# Altium project MB1520.PrjPcb (part 2 of 5)

## Sheet USB OTG FS.SchDoc: USB OTG FS
size A4; CompanyName: STMicroelectronics; Organization: Microcontrollers Division; DocumentNumber: 15; SheetNumber: 7; SheetTotal: 19
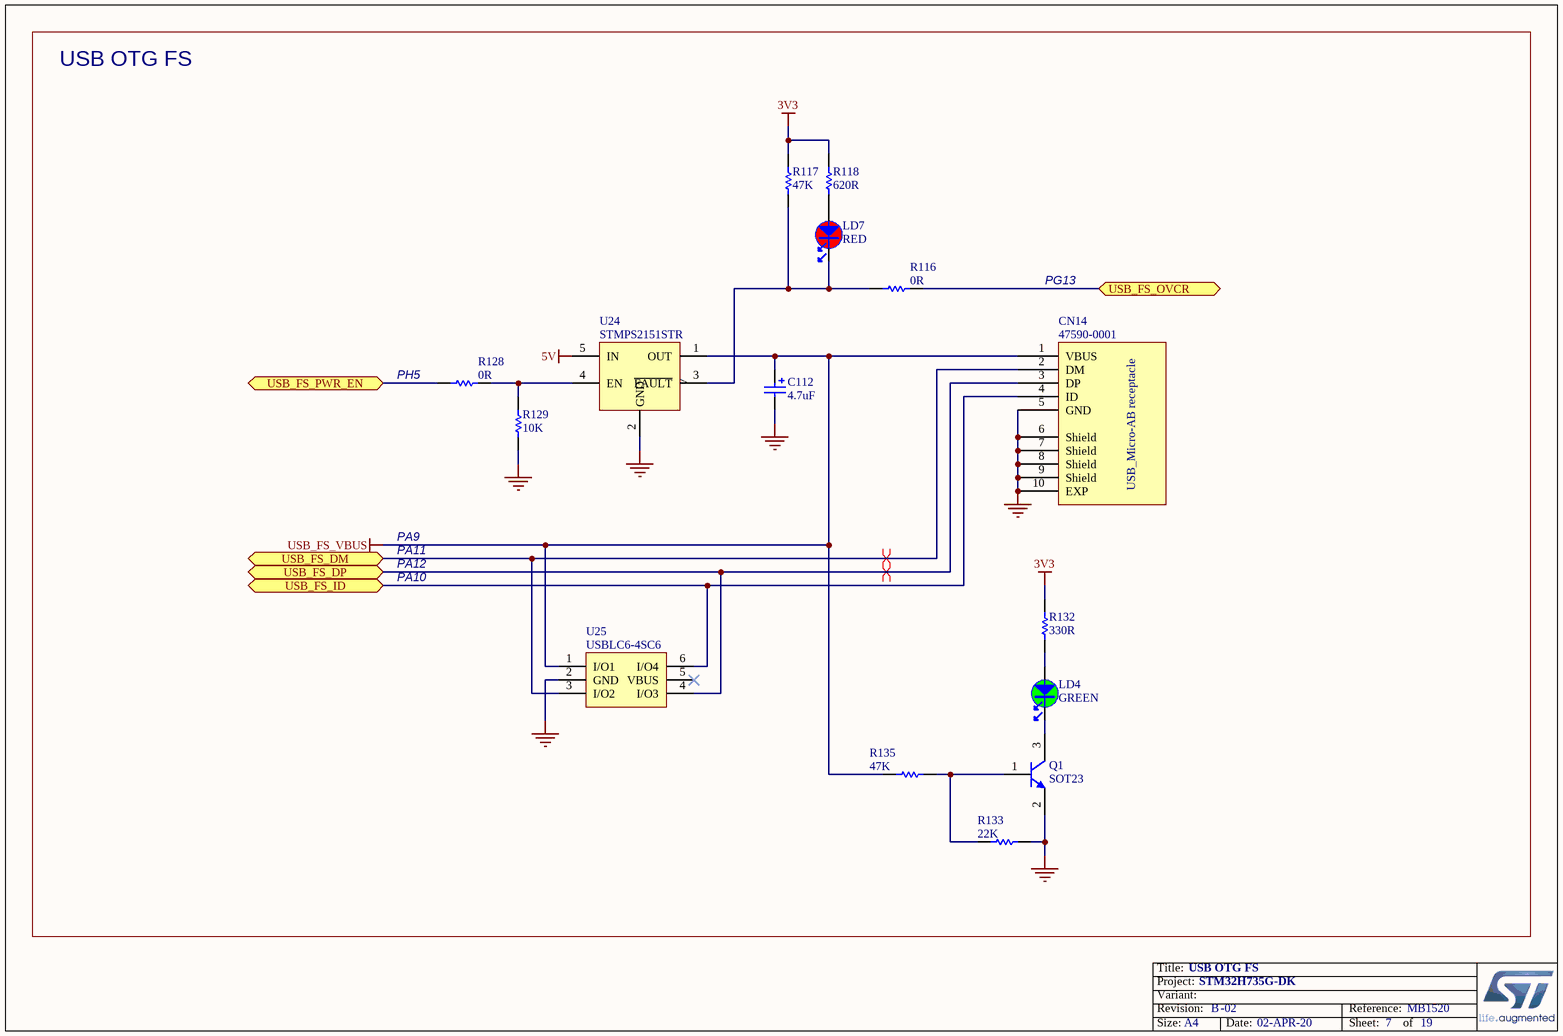
[diagram p5: USB OTG FS.SchDoc]

### Parts
C112  value 4.7uF  [CPOL_VISHAY_TANTAL-595D_1407_H220]  (hidden comment: Cap_POL_TANA)
CN14  Manufacturer_Part_Number: 47590-0001  [CON_USBMICROAB_MOLEX_47590-0001_H3]  (hidden comment: USB_uAB_47590.0001)
LD4  value GREEN  [LED_0603_GREEN]  (hidden comment: LED_green)
LD7  value RED  [LED_0603_RED]  (hidden comment: LED_red)
Q1  value SOT23  [NPN_SOT23]  (hidden comment: 9013-SOT23)
R116  value 0R  [R0402]  (hidden comment: Resistor)
R117  value 47K  [R0402]  (hidden comment: Resistor)
R118  value 620R  [R0402]  (hidden comment: Resistor)
R128  value 0R  [R0402]  (hidden comment: Resistor)
R129  value 10K  [R0402]  (hidden comment: Resistor)
R132  value 330R  [R0402]  (hidden comment: Resistor)
R133  value 22K  [R0402]  (hidden comment: Resistor)
R135  value 47K  [R0402]  (hidden comment: Resistor)
U24  STMPS2151STR  [MOS_SOT23-5L]
U25  USBLC6-4SC6  [ESD_SOT23-6L]

### Ports
USB_FS_DM, USB_FS_DP, USB_FS_ID, USB_FS_OVCR, USB_FS_PWR_EN

### Nets
3V3: R117.2 R118.2 R132.2
5V: U24.5(IN)
GND: C112.2 CN14.5(GND) CN14.6(Shield) CN14.7(Shield) CN14.8(Shield) CN14.9(Shield) CN14.10(EXP) Q1.2(E) R129.1 R133.2 U24.2(GND) U25.2(GND)  [project net POE7]
USB_FS_VBUS: C112.1 CN14.1(VBUS) R135.2 U24.1(OUT) U25.1(I/O1)
USB_FS_DM: CN14.2(DM) U25.3(I/O2) ; port USB_FS_DM
USB_FS_DP: CN14.3(DP) U25.4(I/O3) ; port USB_FS_DP
USB_FS_ID: CN14.4(ID) U25.6(I/O4) ; port USB_FS_ID
USB_FS_OVCR: R116.2 ; port USB_FS_OVCR
USB_FS_PWR_EN: R128.1 ; port USB_FS_PWR_EN
NetLD4_1: LD4.1 R132.1
NetLD4_2: LD4.2 Q1.3(C)
NetLD7_1: LD7.1 R118.1
NetLD7_2: LD7.2 R116.1 R117.1 U24.3(~{FAULT})
NetQ1_1: Q1.1(B) R133.1 R135.1
NetR128_2: R128.2 R129.2 U24.4(EN)

Not connected (* = marked no-connect by the designer): U25 5(VBUS)*

### Layout directives
differential pair: USB_FS_DM, USB_FS_DP

### Notes on the sheet
- USB OTG FS
- PG13
- (near R128) PH5
- PA9
- PA10
- PA11
- PA12
- Title:
- Project:
- Size:
- Revision:
- Variant:
- A4
- -
- Date:
- Reference:
- Sheet:
- of
- (in symbol MCD-00022) USB_Micro-AB receptacle

### Library data of the parts
C112 = MCD-00595: Capacitor, Tantalum, 4.7uF, 16V, +/-10%, 595D case A; Manufacturer_Part_Number: 595D475X9016A2T; Manufacturer: VISHAY; Order_Code_RS: 117-303; Provided_By: SUBCO; Revision: July-2002: Re-released for DXP Platform.; Internal_Part_Number: MCD-00595; Status: Footprint available; Part_Type: Capacitor; ComponentLink1Description: Datasheet; ComponentLink1URL: http://tunmcdsvn.tun.st.com/Component_Datasheet_Library/Trunk/Capacitors/VISHAY_CAPACITOR_TANTALUM_595D; Order_Code_Digikey: 595D475X9016A2T-ND; Order_Code_Farnell: 1166805
CN14 = MCD-00022: USB-MICRO-AB, 0.65mm, RA, SMT, Top Mount (compatible with MCD-00661 USB certified); Part_Type: Connector; Manufacturer: MOLEX; Alternate_Manufacturer_Part_Number: ZX62RD-AB-5P8(30); Alternate_Manufacturer: HIROSE; Provided_By: SUBCO; Internal_Part_Number: MCD-00022; Value: USB_uAB_47590.0001; Status: Released; ComponentLink1Description: Datasheet; ComponentLink1URL: http://tunmcdsvn.tun.st.com/Component_Datasheet_Library/Trunk/Connectors/Molex_Connector-USB-microAB_47590-0001
LD4 = MCD-00050: LED, Green, 0603; Part_Type: Display; Manufacturer_Part_Number: 19-213SYGC/S530-E2/TR8; Manufacturer: EVERLIGHT; Provided_By: SUBCO; Internal_Part_Number: MCD-00050; Status: Released; ComponentLink1Description: Datasheet; ComponentLink1URL: http://tunmcdsvn.tun.st.com/Component_Datasheet_Library/Trunk/Display/Everlight_SMD-LED-GREEN_19-213SYGC-S530-XX-TR8-v3.doc; Package: LED 0603
LD7 = MCD-00049: LED, Red, 0603; Manufacturer_Part_Number: 19-213-R6C-AP1Q2B/3T; Manufacturer: EVERLIGHT; Part_Type: Display; Provided_By: SUBCO; Internal_Part_Number: MCD-00049; ComponentLink1Description: Datasheet; Status: Released; ComponentLink1URL: http://tunmcdsvn.tun.st.com/Component_Datasheet_Library/Trunk/Display/Everlight_SMD-LED-RED_19-213-R6C-AP1Q2B-3T-V3.doc; Package: LED 0603
Q1 = MCD-00073: NPN Bipolar Transistor; Part_Type: IC; Manufacturer_Part_Number: BSR14; Manufacturer: ON SEMICONDUCTOR; Alternate_Manufacturer_Part_Number: MMBT2222ALT1G / MMBT2222ALT3G; Provided_By: SUBCO; Revision: *; Internal_Part_Number: MCD-00073; Status: Released; ComponentLink1Description: Datasheet; ComponentLink1URL: http://tunmcdsvn.tun.st.com/Component_Datasheet_Library/Trunk/IC/NXP_Transistor_BSR14; Alternate_Manufacturer: ON SEMICONDUCTOR
R116 R128 = MCD-00052: Resistor,0R,0402,5%,1/16W; Manufacturer_Part_Number: RC0402JR-070RL; Manufacturer: YAGEO; Provided_By: SUBCO; Internal_Part_Number: MCD-00052; Status: Released; Part_Type: Resistor; Package: R0402; ComponentLink1Description: Datasheet; ComponentLink1URL: http://tunmcdsvn.tun.st.com/Component_Datasheet_Library/Trunk/Resistors/Yageo_Resistor_RC0402-series
R117 R135 = MCD-00063: Resistor,47K,0402,1%,1/16W; Manufacturer_Part_Number: RC0402FR-0747KL; Manufacturer: YAGEO; Provided_By: SUBCO; Internal_Part_Number: MCD-00063; Status: Released; Part_Type: Resistor; Package: R0402; ComponentLink1Description: Datasheet; ComponentLink1URL: http://tunmcdsvn.tun.st.com/Component_Datasheet_Library/Trunk/Resistors/Yageo_Resistor_RC0402-series
R118 = MCD-00499: Resistor,620R,0402,1%,1/16W; Manufacturer_Part_Number: RC0402FR-07620RL; Manufacturer: YAGEO; Provided_By: SUBCO; Internal_Part_Number: MCD-00499; Status: Released; Part_Type: Resistor; Package: R0402; ComponentLink1Description: Datasheet; ComponentLink1URL: http://tunmcdsvn.tun.st.com/Component_Datasheet_Library/Trunk/Resistors/Yageo_Resistor_RC0402-series
R129 = MCD-00053: as R94 on sheet Audio; Internal_Part_Number: MCD-00053; Status: Released; Part_Type: Resistor; Package: R0402; ComponentLink1Description: Datasheet; ComponentLink1URL: http://tunmcdsvn.tun.st.com/Component_Datasheet_Library/Trunk/Resistors/Yageo_Resistor_RC0402-series
R132 = MCD-00062: Resistor,330R,0402,1%,1/16W; Manufacturer_Part_Number: RC0402FR-07330RL; Manufacturer: YAGEO; Provided_By: SUBCO; Internal_Part_Number: MCD-00062; Status: Released; Part_Type: Resistor; Package: R0402; ComponentLink1Description: Datasheet; ComponentLink1URL: http://tunmcdsvn.tun.st.com/Component_Datasheet_Library/Trunk/Resistors/Yageo_Resistor_RC0402-series
R133 = MCD-00429: Resistor,22K,0402,1%,1/16W; Manufacturer_Part_Number: RC0402FR-0722KL; Manufacturer: YAGEO; Provided_By: SUBCO; Internal_Part_Number: MCD-00429; Status: Released; Part_Type: Resistor; Package: R0402; ComponentLink1Description: Datasheet; ComponentLink1URL: http://tunmcdsvn.tun.st.com/Component_Datasheet_Library/Trunk/Resistors/Yageo_Resistor_RC0402-series
U24 = MCD-00159: 500mA, Enhanced single channel power switches with active high enable pin; Part_Type: IC; Manufacturer: STMICROELECTRONICS; Alternate_Manufacturer_Part_Number: TPS2051C; Alternate_Manufacturer: TEXAS INSTRUMENTS; BMS_Part_Number: 9159009; Provided_By: SUBCO with ST control; Internal_Part_Number: MCD-00159; Value: STMPS2151STR; Status: Released; Manufacturer_Part_Number: STMPS2151STR; ComponentLink1Description: Datasheet; ComponentLink1URL: http://tunmcdsvn.tun.st.com/Component_Datasheet_Library/Trunk/IC/STM_PWR-Switch_STMPS2151STR
U25 = MCD-00250: Very low capacitance ESD protection , 4 lines; Part_Type: IC; Manufacturer: STMICROELECTRONICS; BMS_Part_Number: 9151001; Provided_By: SUBCO with ST control; Internal_Part_Number: MCD-00250; Value: USBLC6-4SC6; Status: Released; Manufacturer_Part_Number: USBLC6-4SC6; ComponentLink1Description: Datasheet; ComponentLink1URL: http://tunmcdsvn.tun.st.com/Component_Datasheet_Library/Trunk/Diodes/STM_ESD_USBLC6-4SC6

## Sheet Arduino Connector.SchDoc: Arduino Connector
size A4; CompanyName: STMicroelectronics; Organization: Microcontrollers Division; DocumentNumber: 10; SheetNumber: 16; SheetTotal: 19
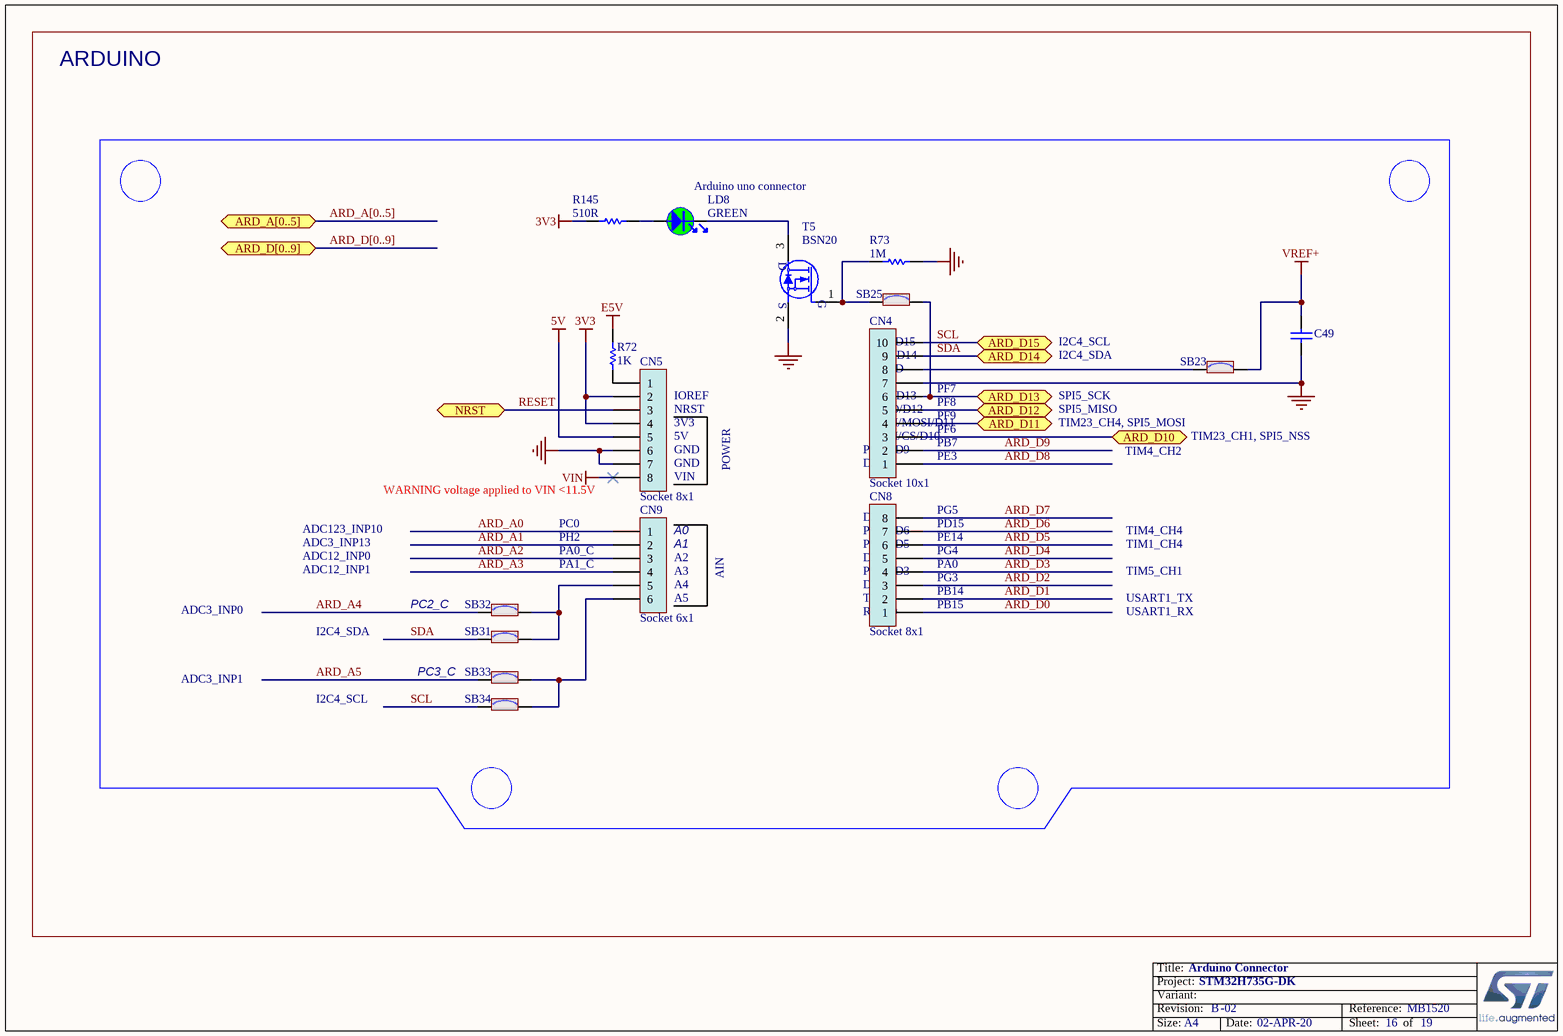
[diagram p6: Arduino Connector.SchDoc]

### Parts
C49  Capacitor  [C0603]  (value not drawn)
CN4  Socket 10x1  [CON_SAMTEC_SSW-110-22-X-S-VS]
CN5  Socket 8x1  [CON_SAMTEC_SSW-108-22-X-S-VS]
CN8  Socket 8x1  [CON_SAMTEC_SSW-108-22-X-S-VS]
CN9  Socket 6x1  [CON_SAMTEC_SSW-106-22-X-S-VS]
LD8  value GREEN  [LED_0603_GREEN]  (hidden comment: LED_green)
R72  value 1K  [R0603]  (hidden comment: Resistor)
R73  value 1M  [R0603]  (hidden comment: Resistor)
R145  value 510R  [R0603]  (hidden comment: Resistor)
SB23  SB_ON  [SOLDER-BRIDGE_R0603-0R]  (value not drawn)
SB25  SB_ON  [SOLDER-BRIDGE_R0603-0R]  (value not drawn)
SB31  SB_ON  [SOLDER-BRIDGE_R0603-0R]  (value not drawn)
SB32  SB_ON  [SOLDER-BRIDGE_R0603-0R]  (value not drawn)
SB33  SB_ON  [SOLDER-BRIDGE_R0603-0R]  (value not drawn)
SB34  SB_ON  [SOLDER-BRIDGE_R0603-0R]  (value not drawn)
T5  BSN20  [MOS_SOT23]

### Ports
ARD_A[0..5], ARD_D10, ARD_D11, ARD_D12, ARD_D13, ARD_D14, ARD_D15, ARD_D[0..9], NRST

### Nets
3V3: CN5.2 CN5.4 R145.2
5V: CN5.5
E5V: R72.1
GND: C49.1 CN4.7 CN5.6 CN5.7 R73.2 T5.2(S)  [project net POE7]
VIN: CN5.8
VREF+: C49.2 SB23.2
ARD_A0: CN9.1
ARD_A1: CN9.2
ARD_A2: CN9.3
ARD_A3: CN9.4
ARD_A4: SB32.1
ARD_A5: SB33.1
ARD_D0: CN8.1
ARD_D1: CN8.2
ARD_D2: CN8.3
ARD_D3: CN8.4
ARD_D4: CN8.5
ARD_D5: CN8.6
ARD_D6: CN8.7
ARD_D7: CN8.8
ARD_D8: CN4.1
ARD_D9: CN4.2
ARD_D10: CN4.3 ; port ARD_D10
ARD_D11: CN4.4 ; port ARD_D11
ARD_D12: CN4.5 ; port ARD_D12
ARD_D13: CN4.6 SB25.2 ; port ARD_D13
RESET: CN5.3 ; port NRST
SCL: CN4.10 SB34.1 ; port ARD_D15
SDA: CN4.9 SB31.1 ; port ARD_D14
NetCN4_8: CN4.8 SB23.1
NetCN5_1: CN5.1 R72.2
NetCN9_5: CN9.5 SB31.2 SB32.2
NetCN9_6: CN9.6 SB33.2 SB34.2
NetLD8_1: LD8.1 R145.1
NetLD8_2: LD8.2 T5.3(D)
NetR73_1: R73.1 SB25.1 T5.1(G)

### Buses and harness runs
bus ARD_A[0..5] = port ARD_A[0..5]
bus ARD_D[0..9] = port ARD_D[0..9]

### Notes on the sheet
- ARDUINO
- (near LD8) Arduino uno connector
- (near CN4) SDA/D14
- SCL/D15
- (near CN4) AVDD
- (near CN4) GND
- I2C4_SCL
- I2C4_SDA
- (near CN5) IOREF
- (near CN5) NRST
- (near CN5) 3V3
- (near CN5) 5V
- (near CN4) PWM/CS/D10
- (near CN4) SCK/D13
- (near CN4) MISO/D12
- (near CN4) PWM/MOSI/D11
- (near CN4) PF6
- (near CN4) PB7
- (near CN4) PF9
- (near CN4) PF8
- (near CN4) PF7
- TIM23_CH4, SPI5_MOSI
- SPI5_MISO
- SPI5_SCK
- TIM23_CH1, SPI5_NSS
- WARNING voltage applied to VIN <11.5V
- (near CN5) GND
- (near CN5) VIN
- POWER
- (near CN8) D7
- (near CN4) D8
- (near CN4) PWM/D9
- PG5
- (near CN4) PE3
- TIM4_CH2
- ADC12_INP1
- ADC12_INP0
- ADC3_INP13
- ADC123_INP10
- PC0
- PH2
- PA0_C
- PA1_C
- (near CN9) A0
- (near CN9) A1
- (near CN9) A2
- (near CN9) A3
- AIN
- (near CN8) D4
- (near CN8) PWM/D3
- (near CN8) PWM/D5
- (near CN8) PWM/D6
- (near CN8) PG3
- (near CN8) PG4
- (near CN8) PE14
- (near CN8) PD15
- (near CN8) PA0
- TIM1_CH4
- TIM5_CH1
- TIM4_CH4
- ADC3_INP0
- PC2_C
- (near CN9) A4
- (near CN9) A5
- (near CN8) RX/D0
- (near CN8) TX/D1
- (near CN8) D2
- (near CN8) PB14
- (near CN8) PB15
- USART1_RX
- USART1_TX
- ADC3_INP1
- PC3_C
- Title:
- Project:
- Size:
- Revision:
- Variant:
- -
- Date:
- Reference:
- Sheet:
- of

### Library data of the parts
C49 = MCD-00211: Capacitor, MLCC, 100nF, 16V, X7R, 10%, 0603, T=0,8mm; Manufacturer_Part_Number: CC0603KRX7R7BB104; Manufacturer: YAGEO; Provided_By: SUBCO; Internal_Part_Number: MCD-00211; Value: 100nF; Status: Released; Part_Type: Capacitor; Package: C0603; ComponentLink1Description: Datasheet; ComponentLink1URL: http://tunmcdsvn.tun.st.com/Component_Datasheet_Library/Trunk/Capacitors/Yageo_Multilayer_Capacitor_X7R_series_100pF_to_22uF
CN4 = MCD-00301: Socket, 10x1, 2.54mm, VR, SMT, Height 9.78mm; Manufacturer_Part_Number: SSW-110-22-L-S-VS; Manufacturer: SAMTEC; Part_Type: Connector; Provided_By: SUBCO; Internal_Part_Number: MCD-00301; Value: Socket 10x1; ComponentLink1Description: Datasheet; Status: Checked; ComponentLink1URL: http://tunmcdsvn.tun.st.com/Component_Datasheet_Library/Trunk/Connectors/Samtec_SSW_smt_series
CN5 = MCD-00300: Socket, 8x1, 2.54mm, VR, SMT, Height 9.78mm; Manufacturer_Part_Number: SSW-108-22-L-S-VS; Manufacturer: SAMTEC; Part_Type: Connector; Provided_By: SUBCO; Internal_Part_Number: MCD-00300; Value: Socket 8x1; ComponentLink1Description: Datasheet; Status: Checked; ComponentLink1URL: http://tunmcdsvn.tun.st.com/Component_Datasheet_Library/Trunk/Connectors/Samtec_SSW_smt_series
CN8 = MCD-00300: Socket, 8x1, 2.54mm, VR, SMT, Height 9.78mm; Part_Type: Connector; Manufacturer_Part_Number: SSW-108-22-L-S-VS; Manufacturer: SAMTEC; Provided_By: SUBCO; Internal_Part_Number: MCD-00300; Value: Socket 8x1; Status: Checked; ComponentLink1Description: Datasheet; ComponentLink1URL: http://tunmcdsvn.tun.st.com/Component_Datasheet_Library/Trunk/Connectors/Samtec_SSW_smt_series
CN9 = MCD-00299: Socket, 6x1, 2.54mm, VR, SMT, Height 9.78mm; Part_Type: Connector; Manufacturer_Part_Number: SSW-106-22-L-S-VS; Manufacturer: SAMTEC; Provided_By: SUBCO; Internal_Part_Number: MCD-00299; Value: Socket 6x1; Status: Checked; ComponentLink1Description: Datasheet; ComponentLink1URL: http://tunmcdsvn.tun.st.com/Component_Datasheet_Library/Trunk/Connectors/Samtec_SSW_smt_series
LD8 = MCD-00050: as LD4 on sheet USB OTG FS; Internal_Part_Number: MCD-00050; Status: Released; ComponentLink1Description: Datasheet; ComponentLink1URL: http://tunmcdsvn.tun.st.com/Component_Datasheet_Library/Trunk/Display/Everlight_SMD-LED-GREEN_19-213SYGC-S530-XX-TR8-v3.doc; Package: LED 0603
R72 = MCD-00070: Resistor,1K,0603,1%,1/10W; Manufacturer_Part_Number: RC0603FR-071KL; Manufacturer: YAGEO; Provided_By: SUBCO; Internal_Part_Number: MCD-00070; Status: Released; Part_Type: Resistor; Package: R0603; ComponentLink1Description: Datasheet; ComponentLink1URL: http://tunmcdsvn.tun.st.com/Component_Datasheet_Library/Trunk/Resistors/Yageo_Resistor_RC0603-series
R73 = MCD-00257: Resistor,1M,0603,1%,1/10W; Manufacturer_Part_Number: RC0603FR-071ML; Manufacturer: YAGEO; Provided_By: SUBCO; Internal_Part_Number: MCD-00257; Status: Released; Part_Type: Resistor; Package: R0603; ComponentLink1Description: Datasheet; ComponentLink1URL: http://tunmcdsvn.tun.st.com/Component_Datasheet_Library/Trunk/Resistors/Yageo_Resistor_RC0603-series
R145 = MCD-00225: Resistor,510R,0603,1%,1/10W; Manufacturer_Part_Number: RC0603FR-07510RL; Manufacturer: YAGEO; Provided_By: SUBCO; Internal_Part_Number: MCD-00225; ComponentLink1Description: Datasheet; Status: Released; Part_Type: Resistor; Package: R0603; ComponentLink1URL: http://tunmcdsvn.tun.st.com/Component_Datasheet_Library/Trunk/Resistors/Yageo_Resistor_RC0603-series
SB23 SB25 SB31-SB34 = MCD-00071: as SB1 on sheet STM32 microcontroller Power; Internal_Part_Number: MCD-00071; Status: Released; Package: SB0603; ComponentLink1Description: Datasheet; ComponentLink1URL: http://tunmcdsvn.tun.st.com/Component_Datasheet_Library/Trunk/Resistors/Yageo_Resistor_RC0603-series
T5 = MCD-00151: N-channel enhancement mode field-effect transistor; Part_Type: IC; Manufacturer: NXP; Provided_By: SUBCO; Internal_Part_Number: MCD-00151; Value: BSN20; Status: Released; Manufacturer_Part_Number: BSN20; ComponentLink1Description: Datasheet; ComponentLink1URL: http://tunmcdsvn.tun.st.com/Component_Datasheet_Library/Trunk/IC/NXP_Transistor_BSN20BK_SOT23

## Sheet STMod+.SchDoc: STMod+
size A4; CompanyName: STMicroelectronics; Organization: Microcontrollers Division; DocumentNumber: 17; SheetNumber: 14; SheetTotal: 19
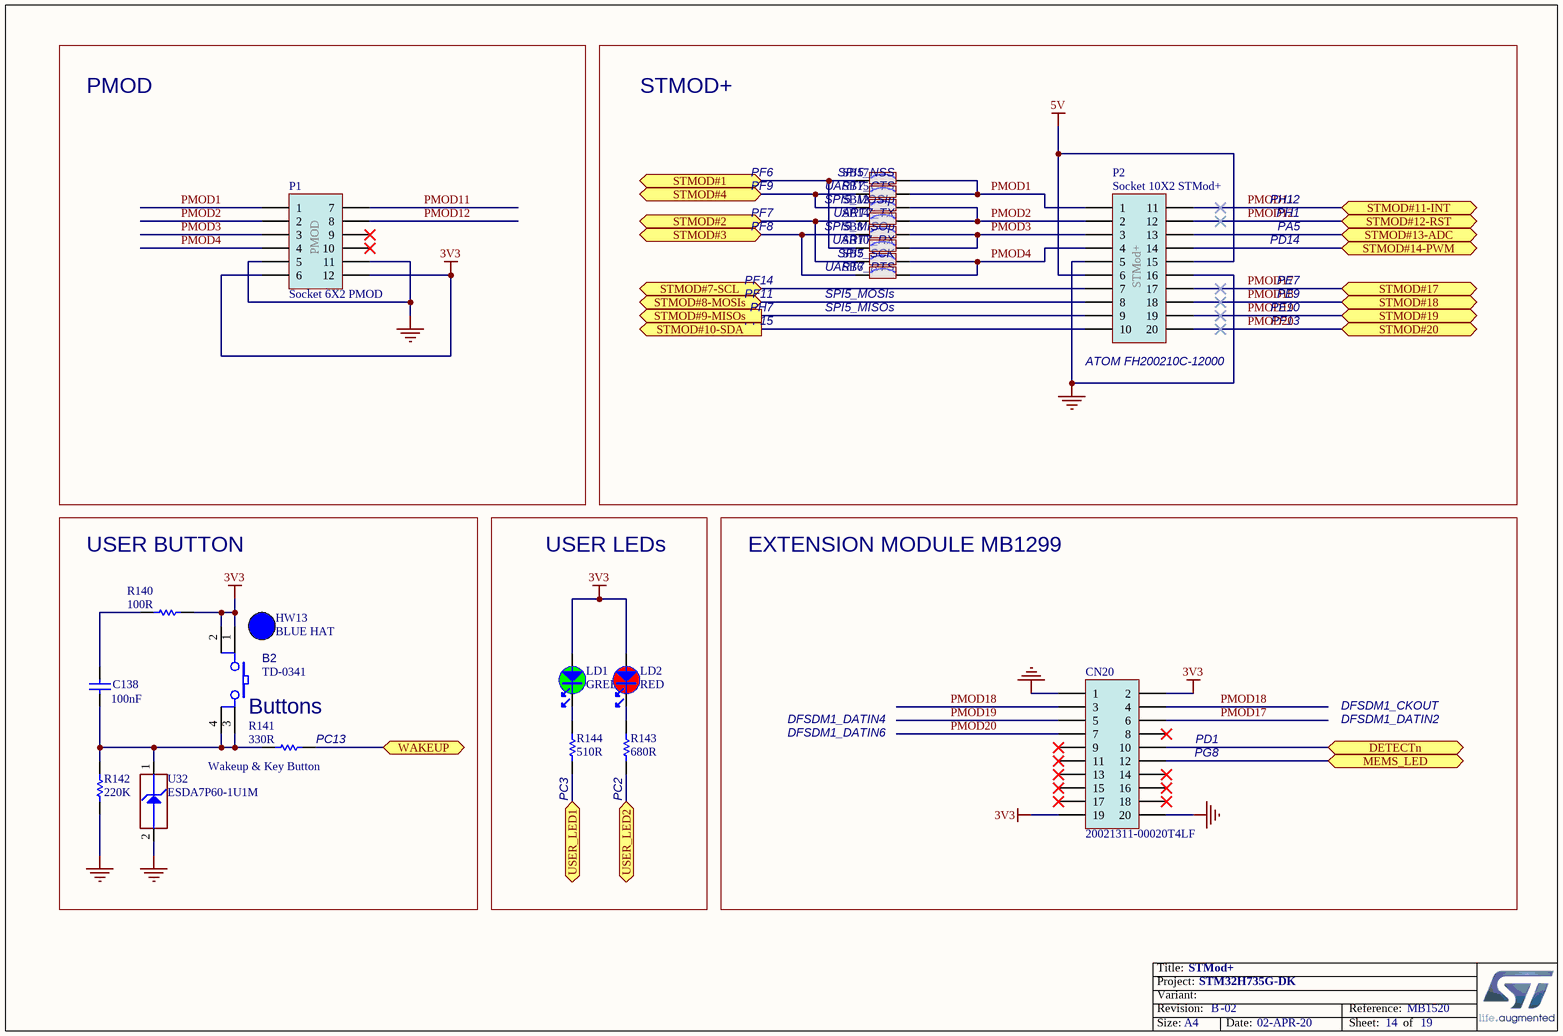
[diagram p7: STMod+.SchDoc]

### Parts
B2  Manufacturer_Part_Number: TD-0341  [SWI_WEALTHMETAL_TD-0341_4P_BLUE]  (hidden comment: SW-PUSH-CMS)
C138  value 100nF  [C0402]  (hidden comment: Capacitor)
CN20  value 20021311-00020T4LF  [CON_FCI_20021311-XXX20XXLF]  (hidden comment: Socket 10x2)
HW13  value BLUE HAT  (hidden comment: BUTTON_HAT_BLUE)  (mechanical)
LD1  value GREEN  [LED_0603_GREEN]  (hidden comment: LED_green)
LD2  value RED  [LED_0603_RED]  (hidden comment: LED_red)
P1  Socket 6X2 PMOD  [CON_SAMTEC_SSW-106-02-F-D-RA__PMOD]
P2  Socket 10X2 STMod+  [CON_SAMTEC_SQT-110-01-F-D-RA__STMOD+]
R140  value 100R  [R0402]  (hidden comment: Resistor)
R141  value 330R  [R0402]  (hidden comment: Resistor)
R142  value 220K  [R0402]  (hidden comment: Resistor)
R143  value 680R  [R0603]  (hidden comment: Resistor)
R144  value 510R  [R0603]  (hidden comment: Resistor)
SB6  SB_ON  [SOLDER-BRIDGE_R0603-0R]  (value not drawn)
SB7  SB_ON  [SOLDER-BRIDGE_R0603-0R]  (value not drawn)
SB8  SB_ON  [SOLDER-BRIDGE_R0603-0R]  (value not drawn)
SB10  SB_ON  [SOLDER-BRIDGE_R0603-0R]  (value not drawn)
SB12  SB_ON  [SOLDER-BRIDGE_R0603-0R]  (value not drawn)
SB14  SB_ON  [SOLDER-BRIDGE_R0603-0R]  (value not drawn)
SB15  SB_ON  [SOLDER-BRIDGE_R0603-0R]  (value not drawn)
SB17  SB_ON  [SOLDER-BRIDGE_R0603-0R]  (value not drawn)
U32  value ESDA7P60-1U1M  [ESD_QFN2_1P6X1_P125]  (hidden comment: ESD-TRANSIL)

### Blocks framed on the sheet
PMOD: P1
STMOD+: P2 SB6-SB8 SB10 SB12 SB14 SB15 SB17
USER LEDs: LD1 LD2 R143 R144
EXTENSION MODULE MB1299: CN20

### Ports
DETECTn, MEMS_LED, STMOD#1, STMOD#2, STMOD#3, STMOD#4, STMOD#7-SCL, STMOD#8-MOSIs, STMOD#9-MISOs (out), STMOD#10-SDA (out), STMOD#11-INT, STMOD#12-RST, STMOD#13-ADC, STMOD#14-PWM, STMOD#17, STMOD#18, STMOD#19, STMOD#20, USER_LED1, USER_LED2, WAKEUP

### Nets
3V3: B2.1 B2.2 CN20.2 CN20.19 LD1.1 LD2.1 P1.6 P1.12 R140.2
5V: P2.6 P2.15
GND: CN20.1 CN20.20 P1.5 P1.11 P2.5 P2.16 R142.1 U32.2(GND)  [project net POE7]
DETECTn: CN20.10 ; port DETECTn
MEMS_LED: CN20.12 ; port MEMS_LED
PF6: SB10.1 SB17.1 ; port STMOD#1
PF7: SB7.1 SB14.1 ; port STMOD#2
PMOD1: P1.1 P2.1 SB15.2 SB17.2
PMOD2: P1.2 P2.2 SB12.2 SB14.2
PMOD3: P1.3 P2.3 SB8.2 SB10.2
PMOD4: P1.4 P2.4 SB6.2 SB7.2
PMOD11: P1.7 P2.11 ; port STMOD#11-INT
PMOD12: P1.8 P2.12 ; port STMOD#12-RST
PMOD17: CN20.6 P2.17 ; port STMOD#17
PMOD18: CN20.3 CN20.4 P2.18 ; port STMOD#18
PMOD19: CN20.5 P2.19 ; port STMOD#19
PMOD20: CN20.7 P2.20 ; port STMOD#20
STMOD#3: SB6.1 SB8.1 ; port STMOD#3
STMOD#4: SB12.1 SB15.1 ; port STMOD#4
STMOD#7-SCL: P2.7 ; port STMOD#7-SCL
STMOD#8-MOSIs: P2.8 ; port STMOD#8-MOSIs
STMOD#9-MISOs: P2.9 ; port STMOD#9-MISOs
STMOD#10-SDA: P2.10 ; port STMOD#10-SDA
STMOD#13-ADC: P2.13 ; port STMOD#13-ADC
STMOD#14-PWM: P2.14 ; port STMOD#14-PWM
USER_LED1: R144.1 ; port USER_LED1
USER_LED2: R143.1 ; port USER_LED2
WAKEUP: R141.2 ; port WAKEUP
NetB2_3: B2.3 B2.4 C138.2 R141.1 R142.2 U32.1(IO1)
NetC138_1: C138.1 R140.1
NetLD1_2: LD1.2 R144.2
NetLD2_2: LD2.2 R143.2

Not connected (* = marked no-connect by the designer): CN20 8* 9* 11* 13* 14* 15* 16* 17* 18*; P1 9* 10*

### Notes on the sheet
- PF6
- (near SB17) SPI5_NSS
- PF9
- PF7
- PF8
- UART7_CTS
- SPI5_MOSIp
- UART7_TX
- SPI5_MISOp
- UART7_RX
- PH1
- PA5
- PH12
- PD14
- PF14
- PF11
- PH7
- SPI5_SCK
- UART7_RTS
- (near SB6) SPI5_MOSIs
- SPI5_MISOs
- PE7
- PE9
- PE10
- PF15
- (near P2) ATOM FH200210C-12000
- PF13
- USER BUTTON
- (near B2) Buttons
- DFSDM1_CKOUT
- (near R141) Wakeup & Key Button
- (near R141) PC13
- DFSDM1_DATIN4
- DFSDM1_DATIN6
- PD1
- PG8
- DFSDM1_DATIN2
- (near R144) PC3
- (near R143) PC2
- Title:
- Project:
- Size:
- Revision:
- Variant:
- A4
- -
- Date:
- Reference:
- Sheet:
- of
- (in symbol MCD-00308) PMOD
- (in symbol MCD-00309) STMod+

### Library data of the parts
B2 = MCD-00002: Non-Open Push-Button 0.1A 24V; Part_Type: Misc; Manufacturer: WEALTHMETAL; Value: SWITCH; Provided_By: SUBCO; Internal_Part_Number: MCD-00002; Status: Released; ComponentLink1Description: Datasheet; ComponentLink1URL: http://tunmcdsvn.tun.st.com/Component_Datasheet_Library/Trunk/Misc/Wealthmetal_Tact-Switch_TD0341
C138 = MCD-00102: Capacitor, MLCC, 100nF, 16V, X7R, 10%, 0402, T=0,5mm; Manufacturer_Part_Number: CC0402KRX7R7BB104; Manufacturer: YAGEO; Alternate_Manufacturer_Part_Number: GCM155R71C104KA55D; Alternate_Manufacturer: MURATA; Provided_By: SUBCO; Internal_Part_Number: MCD-00102; Status: Released; Part_Type: Capacitor; Package: C0402; ComponentLink1Description: Datasheet; ComponentLink1URL: http://tunmcdsvn.tun.st.com/Component_Datasheet_Library/Trunk/Capacitors/Yageo_Multilayer_Capacitor_X7R_series_100pF_to_22uF
CN20 = MCD-00147: Socket for MB1299, 10x2, 1.27mm, VR, TH, Height 4.30mm/2.40mm; Part_Type: Connector; Manufacturer: FCI; Alternate_Manufacturer_Part_Number: 234220S1410; Alternate_Manufacturer: JIUBABA; Provided_By: SUBCO; Internal_Part_Number: MCD-00147; Status: Released; Manufacturer_Part_Number: 20021311-00020T4LF; ComponentLink1Description: Datasheet; ComponentLink1URL: http://tunmcdsvn.tun.st.com/Component_Datasheet_Library/Trunk/Connectors/FCI_Minitek127_Catalog
HW13 = MCD-00634: Blue Hat for switch TD0341X-G01-BLU; Part_Type: Mechanical; Manufacturer_Part_Number: 988.16.09.3.00002_SH-517; Manufacturer: JIUBABA; Provided_By: SUBCO; Internal_Part_Number: MCD-00634; Status: Released; ComponentLink1Description: Datasheet; ComponentLink1URL: http://tunmcdsvn.tun.st.com/Component_Datasheet_Library/Trunk/Mechanical/Jiubaba_HAT_SH-517
LD1 = MCD-00050: LED, Green, 0603; Part_Type: Display; Manufacturer_Part_Number: 19-213SYGC/S530-E2/TR8; Manufacturer: EVERLIGHT; Provided_By: SUBCO; Internal_Part_Number: MCD-00050; Status: Released; ComponentLink1Description: Datasheet; ComponentLink1URL: http://tunmcdsvn.tun.st.com/Component_Datasheet_Library/Trunk/Display/Everlight_SMD-LED-GREEN_19-213SYGC-S530-XX-TR8-v3.doc; Package: LED 0603
LD2 = MCD-00049: LED, Red, 0603; Manufacturer_Part_Number: 19-213-R6C-AP1Q2B/3T; Manufacturer: EVERLIGHT; Part_Type: Display; Provided_By: SUBCO; Internal_Part_Number: MCD-00049; ComponentLink1Description: Datasheet; Status: Released; ComponentLink1URL: http://tunmcdsvn.tun.st.com/Component_Datasheet_Library/Trunk/Display/Everlight_SMD-LED-RED_19-213-R6C-AP1Q2B-3T-V3.doc; Package: LED 0603
P1 = MCD-00308: Socket, 6x2, 2.54mm, TH, RA, Height 8.51mm/7.62mm; Part_Type: Connector; Manufacturer_Part_Number: SSW-106-02-F-D-RA; Manufacturer: SAMTEC; Provided_By: SUBCO; Internal_Part_Number: MCD-00308; Value: Socket 6X2 PMOD; Status: Released; ComponentLink1Description: Datasheet; ComponentLink1URL: http://tunmcdsvn.tun.st.com/Component_Datasheet_Library/Trunk/Connectors/Samtec_SSW_smt_series
P2 = MCD-00309: Socket 10x2, 2.00mm, RA, TH, Height 6.35mm/2.29mm; Part_Type: Connector; Manufacturer_Part_Number: SQT-110-01-F-D-RA; Manufacturer: SAMTEC; Alternate_Manufacturer_Part_Number: FH200020C-12300; Alternate_Manufacturer: JIUBABA; Provided_By: SUBCO; Internal_Part_Number: MCD-00309; Value: Socket 10X2 STMod+; Status: Released; ComponentLink1Description: Datasheet; ComponentLink1URL: http://tunmcdsvn.tun.st.com/Component_Datasheet_Library/Trunk/Connectors/Samtec_SQT_series
R140 = MCD-00119: Resistor,100R,0402,1%,1/16W; Manufacturer_Part_Number: RC0402FR-07100RL; Manufacturer: YAGEO; Provided_By: SUBCO; Internal_Part_Number: MCD-00119; Status: Released; Part_Type: Resistor; Package: R0402; ComponentLink1Description: Datasheet; ComponentLink1URL: http://tunmcdsvn.tun.st.com/Component_Datasheet_Library/Trunk/Resistors/Yageo_Resistor_RC0402-series
R141 = MCD-00062: Resistor,330R,0402,1%,1/16W; Manufacturer_Part_Number: RC0402FR-07330RL; Manufacturer: YAGEO; Provided_By: SUBCO; Internal_Part_Number: MCD-00062; Status: Released; Part_Type: Resistor; Package: R0402; ComponentLink1Description: Datasheet; ComponentLink1URL: http://tunmcdsvn.tun.st.com/Component_Datasheet_Library/Trunk/Resistors/Yageo_Resistor_RC0402-series
R142 = MCD-00164: Resistor,220K,0402,1%,1/16W; Manufacturer_Part_Number: RC0402FR-07220KL; Manufacturer: YAGEO; Provided_By: SUBCO; Internal_Part_Number: MCD-00164; Status: Checked; Part_Type: Resistor; Package: R0402; ComponentLink1Description: Datasheet; ComponentLink1URL: http://tunmcdsvn.tun.st.com/Component_Datasheet_Library/Trunk/Resistors/Yageo_Resistor_RC0402-series
R143 = MCD-00508: Resistor,680R,0603,1%,1/10W; Manufacturer_Part_Number: RC0603FR-07680RL; Manufacturer: YAGEO; ECCN_US: EAR99; ECCN_EU: NEC; Provided_By: SUBCO; Internal_Part_Number: MCD-00508; Status: Released; Part_Type: Resistor; Package: R0603; ComponentLink1Description: Datasheet; ComponentLink1URL: http://tunmcdsvn.tun.st.com/Component_Datasheet_Library/Trunk/Resistors/Yageo_Resistor_RC0603-series
R144 = MCD-00225: Resistor,510R,0603,1%,1/10W; Manufacturer_Part_Number: RC0603FR-07510RL; Manufacturer: YAGEO; Provided_By: SUBCO; Internal_Part_Number: MCD-00225; ComponentLink1Description: Datasheet; Status: Released; Part_Type: Resistor; Package: R0603; ComponentLink1URL: http://tunmcdsvn.tun.st.com/Component_Datasheet_Library/Trunk/Resistors/Yageo_Resistor_RC0603-series
SB6-SB8 SB10 SB12 SB14 SB15 SB17 = MCD-00071: Solder Bridge ON; Part_Type: Mechanical; Manufacturer_Part_Number: RC0603JR-070RL; Manufacturer: YAGEO; Provided_By: SUBCO; Internal_Part_Number: MCD-00071; Status: Released; Package: SB0603; ComponentLink1Description: Datasheet; ComponentLink1URL: http://tunmcdsvn.tun.st.com/Component_Datasheet_Library/Trunk/Resistors/Yageo_Resistor_RC0603-series
U32 = MCD-00251: High power transient voltage suppressor, 7V breakdown; Part_Type: Diode; Manufacturer: STMICROELECTRONICS; BMS_Part_Number: 9179042; Provided_By: SUBCO with ST control; Internal_Part_Number: MCD-00251; Status: Released; Manufacturer_Part_Number: ESDA7P60-1U1M; ComponentLink1Description: Datasheet; ComponentLink1URL: http://tunmcdsvn.tun.st.com/Component_Datasheet_Library/Trunk/Diodes/STM_ESD_ESDA7P60-1U1M

## Sheet STM32 microcontroller IOs.SchDoc: STM32 microcontroller IOs
size A3; CompanyName: STMicroelectronics; Organization: Microcontrollers Division; DocumentNumber: 4; SheetNumber: 3; SheetTotal: 19
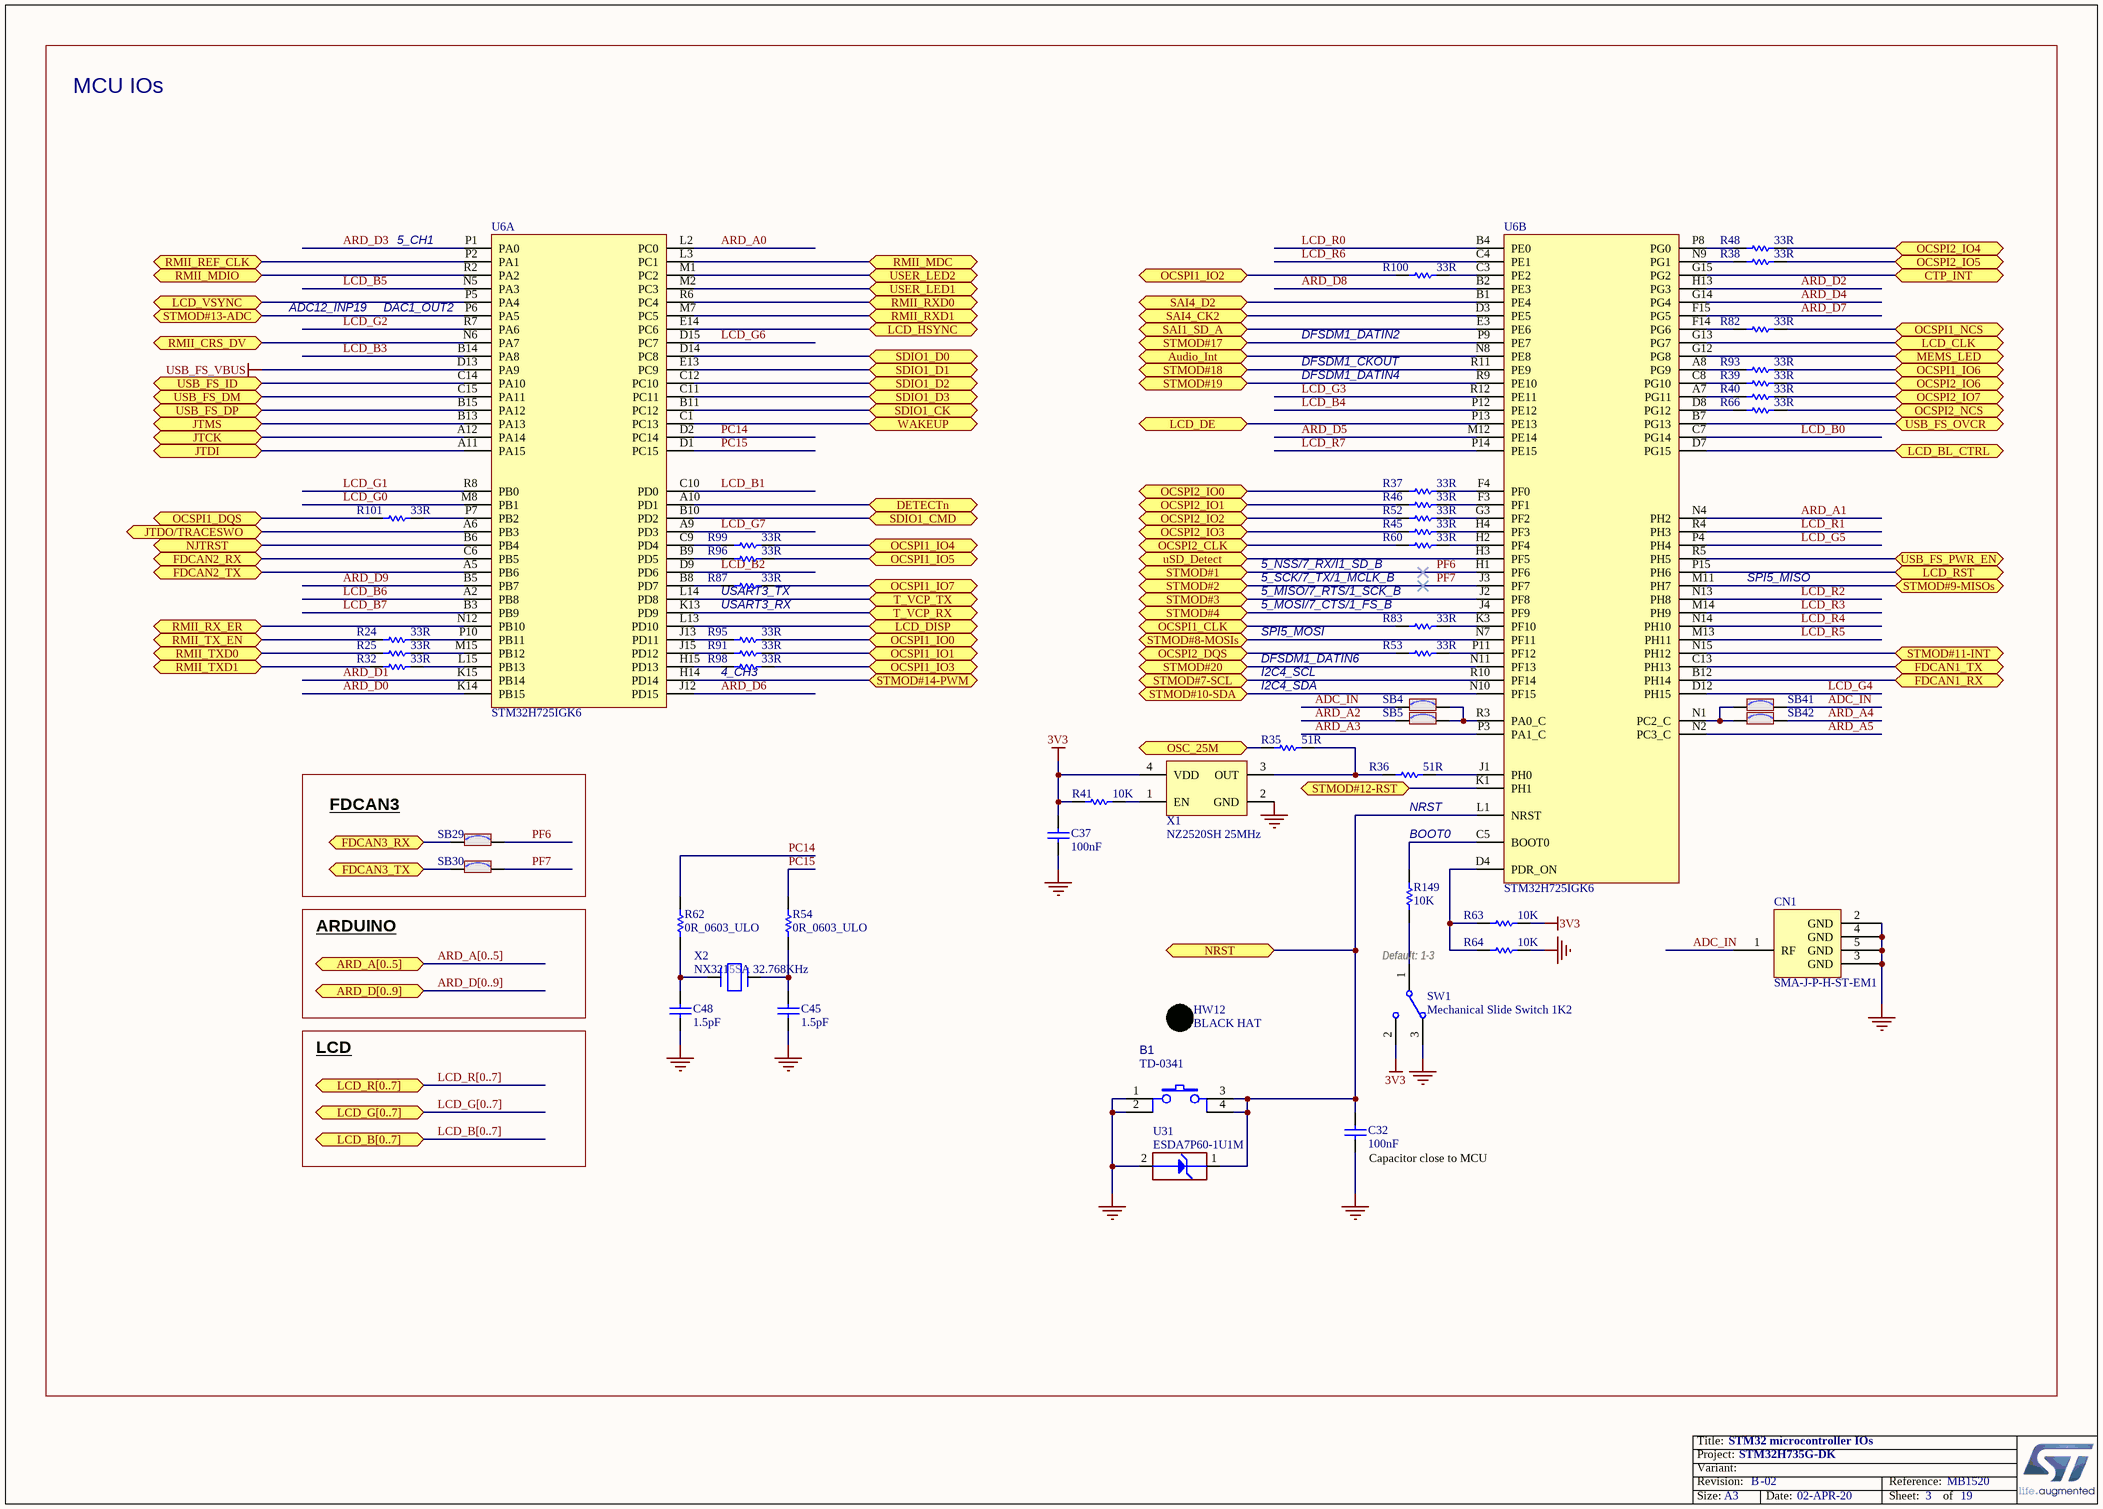
[diagram p8: STM32 microcontroller IOs.SchDoc]

### Parts
B1  Manufacturer_Part_Number: TD-0341  [SWI_WEALTHMETAL_TD-0341_4P_BLACK]  (hidden comment: SW-PUSH-CMS)
C32  value 100nF  [C0402]  (hidden comment: Capacitor)
C37  value 100nF  [C0402]  (hidden comment: Capacitor)
C45  value 1.5pF  [C0402]  (hidden comment: Capacitor)
C48  value 1.5pF  [C0402]  (hidden comment: Capacitor)
CN1  SMA-J-P-H-ST-EM1  [CON_SAMTEC_SMA-J-P-X-ST-EM1]
HW12  value BLACK HAT  (hidden comment: BUTTON_HAT_BLACK)  (mechanical)
R24  value 33R  [R0402]  (hidden comment: Resistor)
R25  value 33R  [R0402]  (hidden comment: Resistor)
R32  value 33R  [R0402]  (hidden comment: Resistor)
R35  value 51R  [R0402]  (hidden comment: Resistor)
R36  value 51R  [R0402]  (hidden comment: Resistor)
R37  value 33R  [R0402]  (hidden comment: Resistor)
R38  value 33R  [R0402]  (hidden comment: Resistor)
R39  value 33R  [R0402]  (hidden comment: Resistor)
R40  value 33R  [R0402]  (hidden comment: Resistor)
R41  value 10K  [R0402]  (hidden comment: Resistor)
R45  value 33R  [R0402]  (hidden comment: Resistor)
R46  value 33R  [R0402]  (hidden comment: Resistor)
R48  value 33R  [R0402]  (hidden comment: Resistor)
R52  value 33R  [R0402]  (hidden comment: Resistor)
R53  value 33R  [R0402]  (hidden comment: Resistor)
R54  value 0R_0603_ULO  [R0603]  (hidden comment: Resistor)
R60  value 33R  [R0402]  (hidden comment: Resistor)
R62  value 0R_0603_ULO  [R0603]  (hidden comment: Resistor)
R63  value 10K  [R0402]  (hidden comment: Resistor)
R64  value 10K  [R0402]  (hidden comment: Resistor)
R66  value 33R  [R0402]  (hidden comment: Resistor)
R82  value 33R  [R0402]  (hidden comment: Resistor)
R83  value 33R  [R0402]  (hidden comment: Resistor)
R87  value 33R  [R0402]  (hidden comment: Resistor)
R91  value 33R  [R0402]  (hidden comment: Resistor)
R93  value 33R  [R0402]  (hidden comment: Resistor)
R95  value 33R  [R0402]  (hidden comment: Resistor)
R96  value 33R  [R0402]  (hidden comment: Resistor)
R98  value 33R  [R0402]  (hidden comment: Resistor)
R99  value 33R  [R0402]  (hidden comment: Resistor)
R100  value 33R  [R0402]  (hidden comment: Resistor)
R101  value 33R  [R0402]  (hidden comment: Resistor)
R149  value 10K  [R0402]  (hidden comment: Resistor)
SB4  SB_ON  [SOLDER-BRIDGE_R0603-0R]  (value not drawn)
SB5  SB_ON  [SOLDER-BRIDGE_R0603-0R]  (value not drawn)
SB29  SB_ON  [SOLDER-BRIDGE_R0603-0R]  (value not drawn)
SB30  SB_ON  [SOLDER-BRIDGE_R0603-0R]  (value not drawn)
SB41  SB_ON  [SOLDER-BRIDGE_R0603-0R]  (value not drawn)
SB42  SB_ON  [SOLDER-BRIDGE_R0603-0R]  (value not drawn)
SW1  value Mechanical Slide Switch 1K2  [SWI_EAO_09-03290-01_EXTENDED_STRAIGHT_BLACK]  (hidden comment: SW_MECA_1K2)
U6  value STM32H725IGK6  [ICC_UFBGA201_176+25_10X10_P065]  (hidden comment: STM32H725IGK6U)  (parts A,B of 3)
U31  value ESDA7P60-1U1M  [ESD_QFN2_1P6X1_P125]  (hidden comment: ESD-TRANSIL)
X1  value NZ2520SH 25MHz  [OSC_NDK_NZ2520SB_4P]  (hidden comment: OSCILLATOR_4_PINS)
X2  value NX3215SA 32.768KHz  [CRY_NX3215SA_2P]  (hidden comment: XTAL_2_PINS)

### Blocks framed on the sheet
FDCAN3: SB29 SB30

### Ports
ARD_A[0..5], ARD_D[0..9], Audio_Int, CTP_INT, DETECTn, FDCAN1_RX, FDCAN1_TX, FDCAN2_RX, FDCAN2_TX, FDCAN3_RX, FDCAN3_TX, JTCK, JTDI, JTDO/TRACESWO, JTMS, LCD_B[0..7], LCD_BL_CTRL, LCD_CLK, LCD_DE, LCD_DISP, LCD_G[0..7], LCD_HSYNC, LCD_R[0..7], LCD_RST, LCD_VSYNC, MEMS_LED, NJTRST, NRST, OCSPI1_CLK, OCSPI1_DQS, OCSPI1_IO0, OCSPI1_IO1, OCSPI1_IO2, OCSPI1_IO3, OCSPI1_IO4, OCSPI1_IO5, OCSPI1_IO6, OCSPI1_IO7, OCSPI1_NCS, OCSPI2_CLK, OCSPI2_DQS, OCSPI2_IO0, OCSPI2_IO1, OCSPI2_IO2, OCSPI2_IO3, OCSPI2_IO4, OCSPI2_IO5, OCSPI2_IO6, OCSPI2_IO7, OCSPI2_NCS, OSC_25M, RMII_CRS_DV, RMII_MDC, RMII_MDIO, RMII_REF_CLK, RMII_RX_ER, RMII_RXD0, RMII_RXD1, RMII_TX_EN, RMII_TXD0, RMII_TXD1, SAI1_SD_A, SAI4_CK2, SAI4_D2, SDIO1_CK, SDIO1_CMD, SDIO1_D0, SDIO1_D1, SDIO1_D2, SDIO1_D3, STMOD#1, STMOD#2, STMOD#3, STMOD#4, STMOD#7-SCL, STMOD#8-MOSIs, STMOD#9-MISOs, STMOD#10-SDA, STMOD#11-INT, STMOD#12-RST, STMOD#13-ADC, STMOD#14-PWM, STMOD#17, STMOD#18, STMOD#19, STMOD#20, T_VCP_RX, T_VCP_TX, USB_FS_DM, USB_FS_DP, USB_FS_ID, USB_FS_OVCR, USB_FS_PWR_EN, uSD_Detect, USER_LED1, USER_LED2, WAKEUP

### Nets
3V3: C37.2 R41.2 R63.1 SW1.2 X1.4(VDD)
GND: B1.1 B1.2 C32.1 C37.1 C45.1 C48.1 CN1.2(GND) CN1.3(GND) CN1.4(GND) CN1.5(GND) R64.1 SW1.3 U31.2(GND) X1.2(GND)  [project net POE7]
USB_FS_VBUS: U6.D13(PA9)
ADC_IN: CN1.1(RF) SB4.1 SB41.2
ARD_A0: U6.L2(PC0)
ARD_A1: U6.N4(PH2)
ARD_A2: SB5.1
ARD_A3: U6.P3(PA1_C)
ARD_A4: SB42.2
ARD_A5: U6.N2(PC3_C)
ARD_D0: U6.K14(PB15)
ARD_D1: U6.K15(PB14)
ARD_D2: U6.H13(PG3)
ARD_D3: U6.P1(PA0)
ARD_D4: U6.G14(PG4)
ARD_D5: U6.M12(PE14)
ARD_D6: U6.J12(PD15)
ARD_D7: U6.F15(PG5)
ARD_D8: U6.B2(PE3)
ARD_D9: U6.B5(PB7)
Audio_Int: U6.N8(PE8) ; port Audio_Int
CTP_INT: U6.G15(PG2) ; port CTP_INT
DETECTn: U6.A10(PD1) ; port DETECTn
FDCAN1_RX: U6.B12(PH14) ; port FDCAN1_RX
FDCAN1_TX: U6.C13(PH13) ; port FDCAN1_TX
FDCAN2_RX: U6.C6(PB5) ; port FDCAN2_RX
FDCAN2_TX: U6.A5(PB6) ; port FDCAN2_TX
FDCAN3_RX: SB29.1 ; port FDCAN3_RX
FDCAN3_TX: SB30.1 ; port FDCAN3_TX
LCD_B0: U6.C7(PG14)
LCD_B1: U6.C10(PD0)
LCD_B2: U6.D9(PD6)
LCD_B3: U6.B14(PA8)
LCD_B4: U6.P12(PE12)
LCD_B5: U6.N5(PA3)
LCD_B6: U6.A2(PB8)
LCD_B7: U6.B3(PB9)
LCD_BL_CTRL: U6.D7(PG15) ; port LCD_BL_CTRL
LCD_CLK: U6.G13(PG7) ; port LCD_CLK
LCD_DE: U6.P13(PE13) ; port LCD_DE
LCD_DISP: U6.L13(PD10) ; port LCD_DISP
LCD_G0: U6.M8(PB1)
LCD_G1: U6.R8(PB0)
LCD_G2: U6.R7(PA6)
LCD_G3: U6.R12(PE11)
LCD_G4: U6.D12(PH15)
LCD_G5: U6.P4(PH4)
LCD_G6: U6.D15(PC7)
LCD_G7: U6.A9(PD3)
LCD_HSYNC: U6.E14(PC6) ; port LCD_HSYNC
LCD_R0: U6.B4(PE0)
LCD_R1: U6.R4(PH3)
LCD_R2: U6.N13(PH8)
LCD_R3: U6.M14(PH9)
LCD_R4: U6.N14(PH10)
LCD_R5: U6.M13(PH11)
LCD_R6: U6.C4(PE1)
LCD_R7: U6.P14(PE15)
LCD_RST: U6.P15(PH6) ; port LCD_RST
LCD_VSYNC: U6.P5(PA4) ; port LCD_VSYNC
MEMS_LED: U6.G12(PG8) ; port MEMS_LED
NJTRST: U6.B6(PB4) ; port NJTRST
OCSPI1_CLK: R83.1 ; port OCSPI1_CLK
OCSPI1_DQS: R101.1 ; port OCSPI1_DQS
OCSPI1_IO0: R95.2 ; port OCSPI1_IO0
OCSPI1_IO1: R91.2 ; port OCSPI1_IO1
OCSPI1_IO2: R100.1 ; port OCSPI1_IO2
OCSPI1_IO3: R98.2 ; port OCSPI1_IO3
OCSPI1_IO4: R99.2 ; port OCSPI1_IO4
OCSPI1_IO5: R96.2 ; port OCSPI1_IO5
OCSPI1_IO6: R93.2 ; port OCSPI1_IO6
OCSPI1_IO7: R87.2 ; port OCSPI1_IO7
OCSPI1_NCS: R82.2 ; port OCSPI1_NCS
OCSPI2_CLK: R60.1 ; port OCSPI2_CLK
OCSPI2_DQS: R53.1 ; port OCSPI2_DQS
OCSPI2_IO0: R37.1 ; port OCSPI2_IO0
OCSPI2_IO1: R46.1 ; port OCSPI2_IO1
OCSPI2_IO2: R52.1 ; port OCSPI2_IO2
OCSPI2_IO3: R45.1 ; port OCSPI2_IO3
OCSPI2_IO4: R48.2 ; port OCSPI2_IO4
OCSPI2_IO5: R38.2 ; port OCSPI2_IO5
OCSPI2_IO6: R39.2 ; port OCSPI2_IO6
OCSPI2_IO7: R40.2 ; port OCSPI2_IO7
OCSPI2_NCS: R66.2 ; port OCSPI2_NCS
OSC_25M: R35.1 ; port OSC_25M
PC14: R62.1 U6.D2(PC14)
PC15: R54.1 U6.D1(PC15)
PF6: SB29.2 U6.H1(PF6) ; port STMOD#1
PF7: SB30.2 U6.J3(PF7) ; port STMOD#2
PMOD11: U6.N15(PH12) ; port STMOD#11-INT
PMOD12: U6.K1(PH1) ; port STMOD#12-RST
PMOD17: U6.P9(PE7) ; port STMOD#17
PMOD18: U6.R11(PE9) ; port STMOD#18
PMOD19: U6.R9(PE10) ; port STMOD#19
PMOD20: U6.N11(PF13) ; port STMOD#20
RESET: B1.3 B1.4 C32.2 U6.L1(NRST) U31.1(IO1) ; port NRST
RMII_CRS_DV: U6.N6(PA7) ; port RMII_CRS_DV
RMII_MDC: U6.L3(PC1) ; port RMII_MDC
RMII_MDIO: U6.R2(PA2) ; port RMII_MDIO
RMII_REF_CLK: U6.P2(PA1) ; port RMII_REF_CLK
RMII_RX_ER: U6.N12(PB10) ; port RMII_RX_ER
RMII_RXD0: U6.R6(PC4) ; port RMII_RXD0
RMII_RXD1: U6.M7(PC5) ; port RMII_RXD1
RMII_TX_EN: R24.1 ; port RMII_TX_EN
RMII_TXD0: R25.1 ; port RMII_TXD0
RMII_TXD1: R32.1 ; port RMII_TXD1
SAI1_SD_A: U6.E3(PE6) ; port SAI1_SD_A
SAI4_CK2: U6.D3(PE5) ; port SAI4_CK2
SAI4_D2: U6.B1(PE4) ; port SAI4_D2
SDIO1_CK: U6.B11(PC12) ; port SDIO1_CK
SDIO1_CMD: U6.B10(PD2) ; port SDIO1_CMD
SDIO1_D0: U6.D14(PC8) ; port SDIO1_D0
SDIO1_D1: U6.E13(PC9) ; port SDIO1_D1
SDIO1_D2: U6.C12(PC10) ; port SDIO1_D2
SDIO1_D3: U6.C11(PC11) ; port SDIO1_D3
STMOD#3: U6.J2(PF8) ; port STMOD#3
STMOD#4: U6.J4(PF9) ; port STMOD#4
STMOD#7-SCL: U6.R10(PF14) ; port STMOD#7-SCL
STMOD#8-MOSIs: U6.N7(PF11) ; port STMOD#8-MOSIs
STMOD#9-MISOs: U6.M11(PH7) ; port STMOD#9-MISOs
STMOD#10-SDA: U6.N10(PF15) ; port STMOD#10-SDA
STMOD#13-ADC: U6.P6(PA5) ; port STMOD#13-ADC
STMOD#14-PWM: U6.H14(PD14) ; port STMOD#14-PWM
T_JTDI: U6.A11(PA15) ; port JTDI
T_SWCLK: U6.A12(PA14) ; port JTCK
T_SWDIO: U6.B13(PA13) ; port JTMS
T_SWO: U6.A6(PB3) ; port JTDO/TRACESWO
T_VCP_RX: U6.K13(PD9) ; port T_VCP_RX
T_VCP_TX: U6.L14(PD8) ; port T_VCP_TX
USB_FS_DM: U6.C15(PA11) ; port USB_FS_DM
USB_FS_DP: U6.B15(PA12) ; port USB_FS_DP
USB_FS_ID: U6.C14(PA10) ; port USB_FS_ID
USB_FS_OVCR: U6.B7(PG13) ; port USB_FS_OVCR
USB_FS_PWR_EN: U6.R5(PH5) ; port USB_FS_PWR_EN
uSD_Detect: U6.H3(PF5) ; port uSD_Detect
USER_LED1: U6.M2(PC3) ; port USER_LED1
USER_LED2: U6.M1(PC2) ; port USER_LED2
WAKEUP: U6.C1(PC13) ; port WAKEUP
NetC45_2: C45.2 R54.2 X2.1(X1)
NetC48_2: C48.2 R62.2 X2.2(X2)
NetR24_2: R24.2 U6.P10(PB11)
NetR25_2: R25.2 U6.M15(PB12)
NetR32_2: R32.2 U6.L15(PB13)
NetR35_2: R35.2 R36.1 X1.3(OUT)
NetR36_2: R36.2 U6.J1(PH0)
NetR37_2: R37.2 U6.F4(PF0)
NetR38_1: R38.1 U6.N9(PG1)
NetR39_1: R39.1 U6.C8(PG10)
NetR40_1: R40.1 U6.A7(PG11)
NetR41_1: R41.1 X1.1(EN)
NetR45_2: R45.2 U6.H4(PF3)
NetR46_2: R46.2 U6.F3(PF1)
NetR48_1: R48.1 U6.P8(PG0)
NetR52_2: R52.2 U6.G3(PF2)
NetR53_2: R53.2 U6.P11(PF12)
NetR60_2: R60.2 U6.H2(PF4)
NetR63_2: R63.2 R64.2 U6.D4(PDR_ON)
NetR66_1: R66.1 U6.D8(PG12)
NetR82_1: R82.1 U6.F14(PG6)
NetR83_2: R83.2 U6.K3(PF10)
NetR87_1: R87.1 U6.B8(PD7)
NetR91_1: R91.1 U6.J15(PD12)
NetR93_1: R93.1 U6.A8(PG9)
NetR95_1: R95.1 U6.J13(PD11)
NetR96_1: R96.1 U6.B9(PD5)
NetR98_1: R98.1 U6.H15(PD13)
NetR99_1: R99.1 U6.C9(PD4)
NetR100_2: R100.2 U6.C3(PE2)
NetR101_2: R101.2 U6.P7(PB2)
NetR149_1: R149.1 U6.C5(BOOT0)
NetR149_2: R149.2 SW1.1
NetSB4_2: SB4.2 SB5.2 U6.R3(PA0_C)
NetSB41_1: SB41.1 SB42.1 U6.N1(PC2_C)

### Buses and harness runs
bus ARD_A[0..5] = port ARD_A[0..5]
bus ARD_D[0..9] = port ARD_D[0..9]
bus LCD_B[0..7] = port LCD_B[0..7]
bus LCD_G[0..7] = port LCD_G[0..7]
bus LCD_R[0..7] = port LCD_R[0..7]

### Notes on the sheet
- MCU IOs
- 5_CH1
- ADC12_INP19
- (near U6) DAC1_OUT2
- DFSDM1_DATIN2
- DFSDM1_CKOUT
- DFSDM1_DATIN4
- 5_NSS/7_RX/I1_SD_B
- 5_SCK/7_TX/1_MCLK_B
- SPI5_MISO
- (near R87) USART3_TX
- (near R87) USART3_RX
- 5_MISO/7_RTS/1_SCK_B
- 5_MOSI/7_CTS/1_FS_B
- SPI5_MOSI
- (near R98) 4_CH3
- DFSDM1_DATIN6
- I2C4_SDA
- I2C4_SCL
- BOOT0
- (near R36) NRST
- ARDUINO
- Default: 1-3
- LCD
- (near C32) Capacitor close to MCU
- Title:
- Project:
- Size:
- Revision:
- Variant:
- A3
- -
- Date:
- Reference:
- Sheet:
- of

### Library data of the parts
B1 = MCD-00001: Non-Open Push-Button 0.1A 24V BLACK; Part_Type: Misc; Manufacturer: WEALTHMETAL; Value: SWITCH; Provided_By: SUBCO; Internal_Part_Number: MCD-00001; Status: Released; ComponentLink1Description: Datasheet; ComponentLink1URL: http://tunmcdsvn.tun.st.com/Component_Datasheet_Library/Trunk/Misc/Wealthmetal_Tact-Switch_TD0341
C32 C37 = MCD-00102: as C138 on sheet STMod+; Internal_Part_Number: MCD-00102; Status: Released; Part_Type: Capacitor; Package: C0402; ComponentLink1Description: Datasheet; ComponentLink1URL: http://tunmcdsvn.tun.st.com/Component_Datasheet_Library/Trunk/Capacitors/Yageo_Multilayer_Capacitor_X7R_series_100pF_to_22uF
C45 C48 = MCD-00563: Capacitor, MLCC, 1.5pF, 50V, NPO, +-0.25pF, 0402, T=0,5mm; Manufacturer_Part_Number: CC0402CRNPO9BN1R5; Manufacturer: YAGEO; Provided_By: SUBCO; Internal_Part_Number: MCD-00563; Status: Released; Part_Type: Capacitor; Package: C0402; ComponentLink1Description: Datasheet; ComponentLink1URL: http://tunmcdsvn.tun.st.com/Component_Datasheet_Library/Trunk/Capacitors/Yageo_Capacitor_NP0_16V-to-50V
CN1 = MCD-00279: RF SMA connector PCB edge; Manufacturer: SAMTEC; ECCN_US: EAR99; ECCN_EU: NEC; Provided_By: SUBCO; Internal_Part_Number: MCD-00279; Value: SMA-J-P-H-ST-EM1; Status: Released; Part_Type: Connector; Manufacturer_Part_Number: SMA-J-P-H-ST-EM1; ComponentLink1Description: Datasheet; ComponentLink1URL: http://tunmcdsvn.tun.st.com/Component_Datasheet_Library/Trunk/Connectors/Samtec_sma_SMA_series
HW12 = MCD-00635: Black Hat for switch TD0341X-G01-BLA; Part_Type: Mechanical; Manufacturer_Part_Number: 988.16.09.3.00003_SH-517; Manufacturer: JIUBABA; Provided_By: SUBCO; Internal_Part_Number: MCD-00635; Status: Released; ComponentLink1Description: Datasheet; ComponentLink1URL: http://tunmcdsvn.tun.st.com/Component_Datasheet_Library/Trunk/Mechanical/Jiubaba_HAT_SH-517
R24 R25 R32 R37-R40 R45 R46 R48 R52 R53 R60 R66 R82 R83 R87 R91 R93 R95 R96 R98-R101 = MCD-00455: Resistor,33R,0402,1%,1/16W; Manufacturer_Part_Number: RC0402FR-0733RL; Manufacturer: YAGEO; Provided_By: SUBCO; Internal_Part_Number: MCD-00455; Status: Released; Part_Type: Resistor; Package: R0402; ComponentLink1Description: Datasheet; ComponentLink1URL: http://tunmcdsvn.tun.st.com/Component_Datasheet_Library/Trunk/Resistors/Yageo_Resistor_RC0402-series
R35 R36 = MCD-00485: Resistor,51R,0402,1%,1/16W; Manufacturer_Part_Number: RC0402FR-0751RL; Manufacturer: YAGEO; Provided_By: SUBCO; Internal_Part_Number: MCD-00485; Status: Released; Part_Type: Resistor; Package: R0402; ComponentLink1Description: Datasheet; ComponentLink1URL: http://tunmcdsvn.tun.st.com/Component_Datasheet_Library/Trunk/Resistors/Yageo_Resistor_RC0402-series
R41 R63 R64 R149 = MCD-00053: Resistor,10K,0402,1%,1/16W; Manufacturer_Part_Number: RC0402FR-0710KL; Manufacturer: YAGEO; Provided_By: SUBCO; Internal_Part_Number: MCD-00053; Status: Released; Part_Type: Resistor; Package: R0402; ComponentLink1Description: Datasheet; ComponentLink1URL: http://tunmcdsvn.tun.st.com/Component_Datasheet_Library/Trunk/Resistors/Yageo_Resistor_RC0402-series
R54 R62 = MCD-00181: Resistor,0R,0603,ULO; Manufacturer_Part_Number: PMR03EZPJ000; Manufacturer: ROHM; Provided_By: SUBCO; Internal_Part_Number: MCD-00181; Status: Released; Part_Type: Resistor; Package: R0603; ComponentLink1Description: Datasheet; ComponentLink1URL: http://tunmcdsvn.tun.st.com/Component_Datasheet_Library/Trunk/Resistors/ROHM_ULtra_low_Ohmic_Resistor_PMR10EZPJ000
SB4 SB5 SB29 SB30 SB41 SB42 = MCD-00071: as SB6-SB8 on sheet STMod+; Internal_Part_Number: MCD-00071; Status: Released; Package: SB0603; ComponentLink1Description: Datasheet; ComponentLink1URL: http://tunmcdsvn.tun.st.com/Component_Datasheet_Library/Trunk/Resistors/Yageo_Resistor_RC0603-series
SW1 = MCD-00566: Mechanical Slide Switches 1K2 BLK ACT GOLD STRT MNT; Part_Type: Misc; Manufacturer_Part_Number: 09.03290.01; Manufacturer: EAO; Provided_By: SUBCO; Internal_Part_Number: MCD-00566; Status: Checked; ComponentLink1Description: Datasheet; ComponentLink1URL: http://tunmcdsvn.tun.st.com/Component_Datasheet_Library/Trunk/Misc/EAO_SWITCH_09.03290.01; ECCN_US: n/a; ECCN_EU: n/a
U6 = MCD-01673: STM32H725IGK6 MCU, Cut1.0, 10x10x0.6mm, Pitch0.65mm, Int SMPS; Part_Type: IC; Manufacturer: STMICROELECTRONICS; ECCN_US: 3A991A2; ECCN_EU: NEC; Provided_By: SUBCO with ST control; Internal_Part_Number: MCD-01673; Status: Checked; Manufacturer_Part_Number: STM32H725IGK6; Package: UFBGA176+25; ComponentLink1Description: Datasheet; ComponentLink1URL: http://tunmcdsvn.tun.st.com/Component_Datasheet_Library/Trunk/IC/STM_MCU_STM32H725IGK6U_UFBGA176
U31 = MCD-00251: as U32 on sheet STMod+; Internal_Part_Number: MCD-00251; Status: Released; Manufacturer_Part_Number: ESDA7P60-1U1M; ComponentLink1Description: Datasheet; ComponentLink1URL: http://tunmcdsvn.tun.st.com/Component_Datasheet_Library/Trunk/Diodes/STM_ESD_ESDA7P60-1U1M
X1 = MCD-00597: Oscillator 25Mhz, +-50ppm, Vcc:3.3V typ, square wave: [0.1Vcc;0.9Vcc], Enable pin, SMD; Part_Type: Crystal_Osc; Manufacturer_Part_Number: NZ2520SH 25MHz END4869C; Manufacturer: NDK; Alternate_Manufacturer_Part_Number: NZ2520SB 25MHz END4869B; BMS_Part_Number: 9157050; Provided_By: SUBCO; Internal_Part_Number: MCD-00597; Status: Released; Alternate_Manufacturer: NDK; ComponentLink1Description: Datasheet; ComponentLink1URL: http://tunmcdsvn.tun.st.com/Component_Datasheet_Library/Trunk/Crystal_Osc/NDK_NZ2520SH 25MHz END4869C
X2 = MCD-00091: Crystal 32.768kHz, 6pF, +-20ppm, 50Kohms max, SMD; Part_Type: Crystal_Osc; Manufacturer_Part_Number: NX3215SA 32.768KHz EXS00A-MU00525; Manufacturer: NDK; BMS_Part_Number: 9157034; Provided_By: SUBCO; Internal_Part_Number: MCD-00091; Status: Released; ComponentLink1Description: Datasheet; ComponentLink1URL: http://tunmcdsvn.tun.st.com/Component_Datasheet_Library/Trunk/Crystal_Osc/NDK_Crystal-For-ST_NX3215SA 32.768KHz EXS00A-MU00525 (EXS10B-21238); Order_Code_Digikey: 644-1386